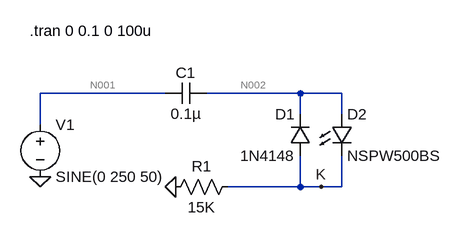
[diagram p0: schematic 230Vpresence.asc]
230Vpresence.asc, the LTspice schematic file:
Version 4
SHEET 1 880 680
WIRE 80 112 -112 112
WIRE 288 112 144 112
WIRE 352 112 288 112
WIRE 288 144 288 112
WIRE 352 144 352 112
WIRE -112 160 -112 112
WIRE 288 256 288 208
WIRE 288 256 176 256
WIRE 320 256 288 256
WIRE 352 256 352 208
WIRE 352 256 320 256
FLAG -112 240 0
FLAG 96 256 0
FLAG 320 256 K
SYMBOL voltage -112 144 R0
WINDOW 123 0 0 Left 0
WINDOW 39 0 0 Left 0
SYMATTR InstName V1
SYMATTR Value SINE(0 250 50)
SYMBOL res 192 240 R90
WINDOW 0 0 56 VBottom 2
WINDOW 3 32 56 VTop 2
SYMATTR InstName R1
SYMATTR Value 15K
SYMATTR SpiceLine tol=1 pwr=0.1
SYMBOL diode 304 208 R180
WINDOW 0 24 64 Left 2
WINDOW 3 24 0 Left 2
SYMATTR InstName D1
SYMATTR Value 1N4148
SYMBOL LED 336 144 R0
SYMATTR InstName D2
SYMATTR Value NSPW500BS
SYMBOL cap 144 96 R90
WINDOW 0 0 32 VBottom 2
WINDOW 3 32 32 VTop 2
SYMATTR InstName C1
SYMATTR Value 0.1µ
SYMATTR SpiceLine V=630 Irms=556m Rser=0.01433 Lser=0 mfg="KEMET" pn="C1812C104KBRAC" type="X7R"
TEXT -128 16 Left 2 !.tran 0 0.1 0 100u

The netlist it stands for:
* 230Vpresence.asc
V1 N001 0 SINE(0 250 50)
R1 K 0 15K tol=1 pwr=0.1
D1 K N002 1N4148
D2 N002 K NSPW500BS
C1 N002 N001 0.1µ V=630 Irms=556m Rser=0.01433 Lser=0 mfg="KEMET" pn="C1812C104KBRAC" type="X7R"
.model D D
.lib standard.dio
.tran 0 0.1 0 100u
.backanno
.end

* Results of the author's LTspice run, read from the files saved beside the schematic
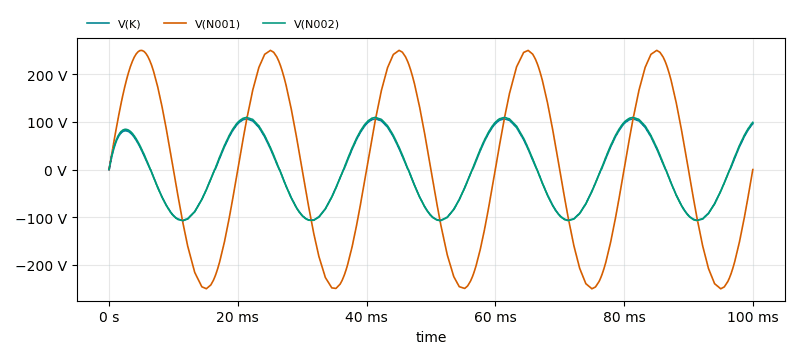
[diagram p1: Transient Analysis of 230Vpresence.asc, plotted from the saved traces]
* Transient Analysis, 1 run:
*   V(K): min -106.4 V, max 106.4 V, average -1.46 V, rms 73.53 V, last 95.99 V
*   V(N001): min -250 V, max 250 V, average 55.92 mV, rms 176.6 V, last 0 V
*   V(N002): min -107.1 V, max 109.4 V, average -339.2 mV, rms 75.14 V, last 99.01 V